# EAGLE design DMXW_Driver_Board (EAGLE 6.5.0)
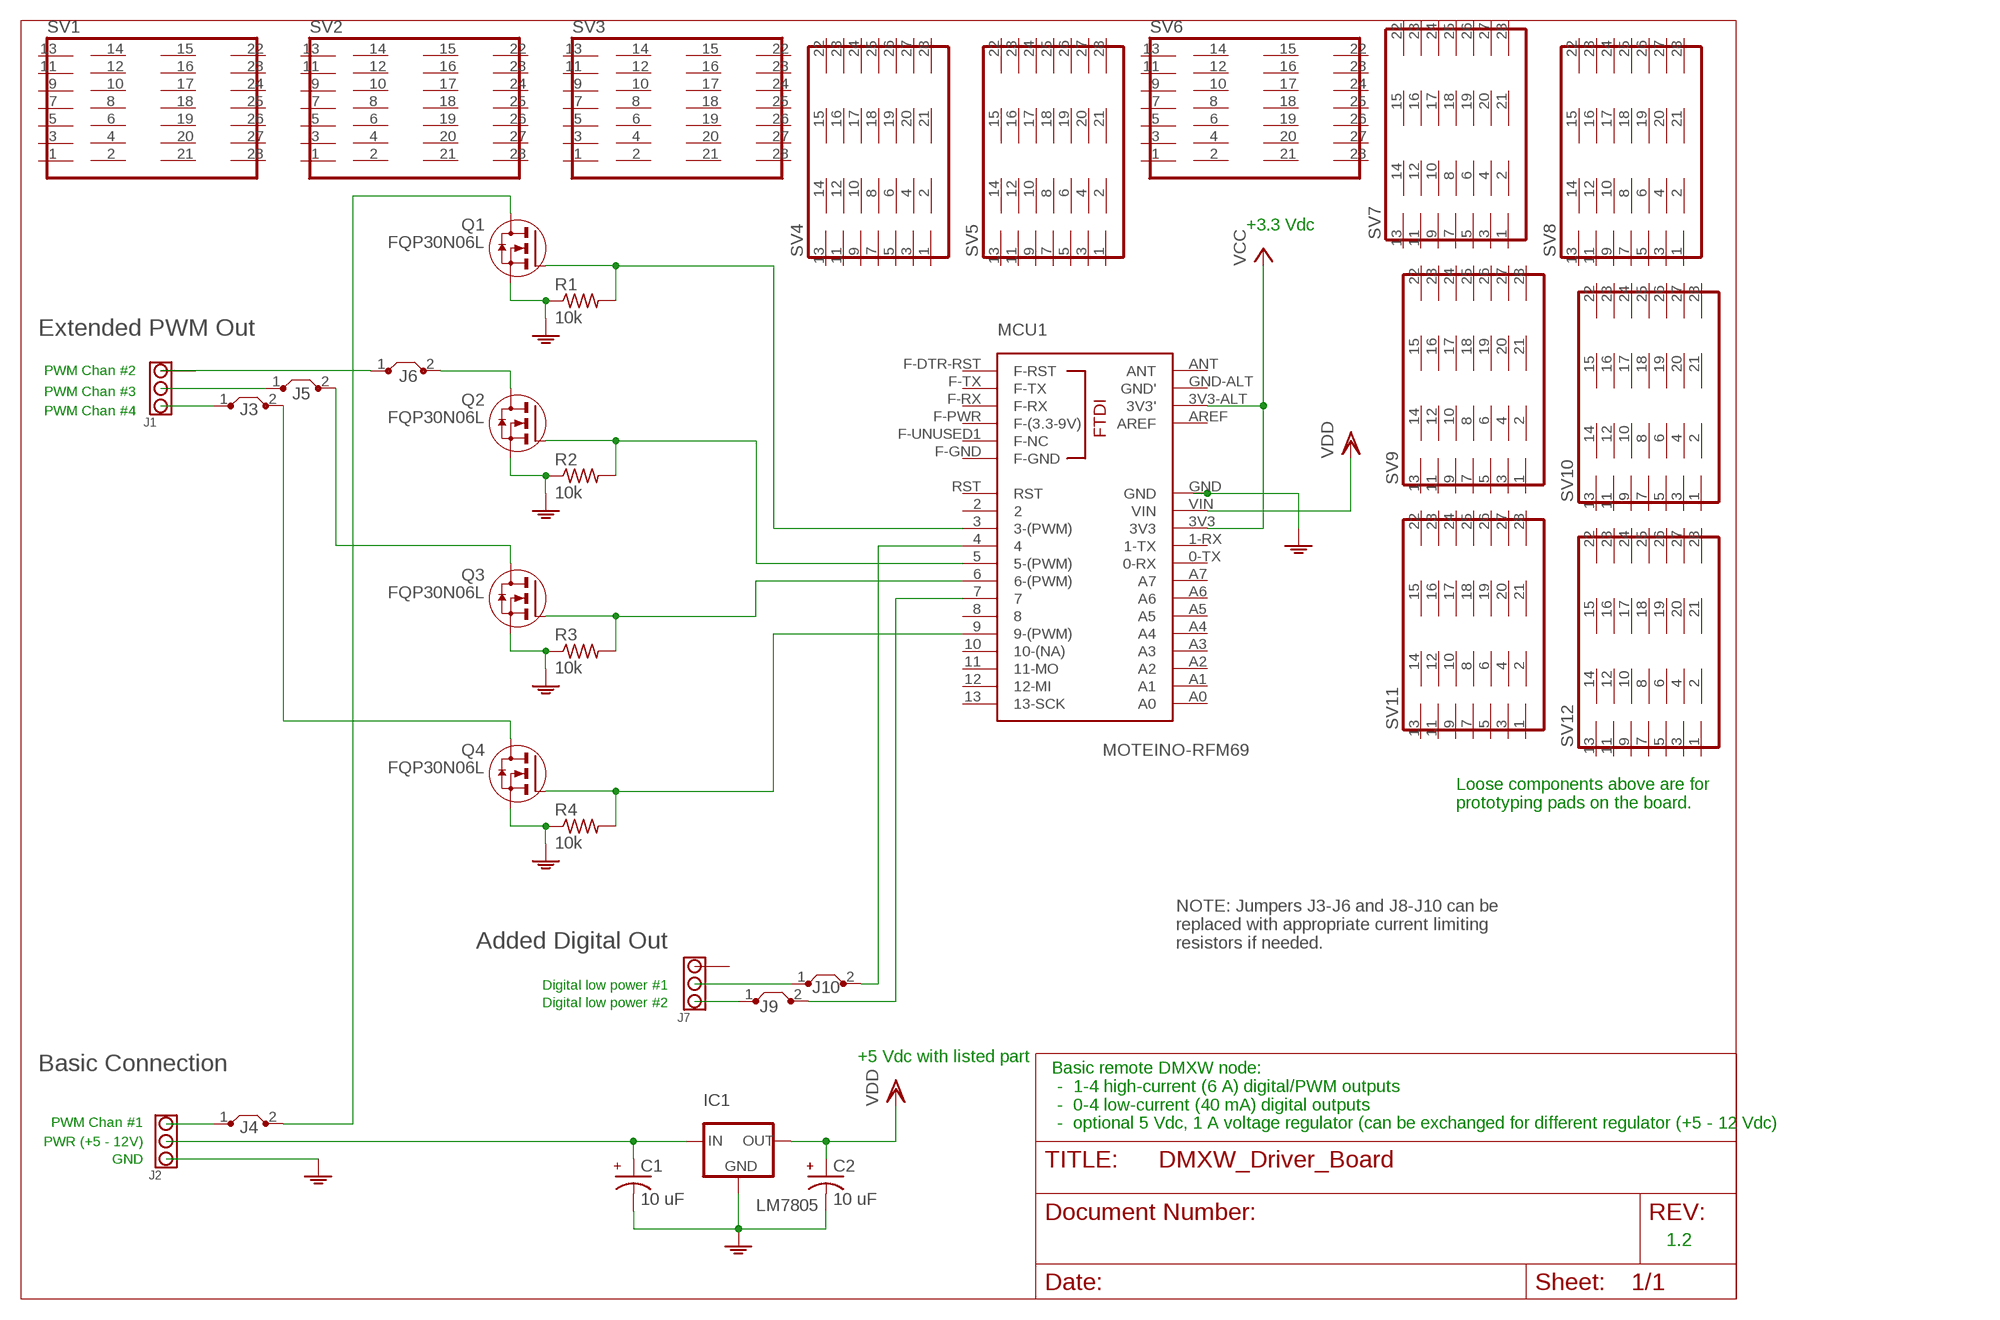
[diagram p0: schematic, sheet 1]

## Parts
C1  10 uF  CAPACITOR-ELECTROLYTICCANISTERRADIAL  [RADIAL-CANISTER]
C2  10 uF  CAPACITOR-ELECTROLYTICCANISTERRADIAL  [RADIAL-CANISTER]
IC1  LM7805  78XX-VOLTAGEREGULATORS  [TO-220]
J1  TERMINAL-BLOCK-3  [W237-103]
J2  TERMINAL-BLOCK-3  [W237-103]
J3  J5MM  [05]
J4  J5MM  [05]
J5  J5MM  [05]
J6  J5MM  [05]
J7  TERMINAL-BLOCK-3  [W237-103]
J9  J5MM  [05]
J10  J5MM  [05]
MCU1  MOTEINO-RFM69  [MOTEINO]
Q1  FQP30N06L  MOSFET-N-FQP30N06L  [TO-220]
Q2  FQP30N06L  MOSFET-N-FQP30N06L  [TO-220]
Q3  FQP30N06L  MOSFET-N-FQP30N06L  [TO-220]
Q4  FQP30N06L  MOSFET-N-FQP30N06L  [TO-220]
R1  10k  R-US_0207/10  [0207/10]
R2  10k  R-US_0207/10  [0207/10]
R3  10k  R-US_0207/10  [0207/10]
R4  10k  R-US_0207/10  [0207/10]
SV1  14P  [14P]
SV2  14P  [14P]
SV3  14P  [14P]
SV4  14P  [14P]
SV5  14P  [14P]
SV6  14P  [14P]
SV7  14P  [14P]
SV8  14P  [14P]
SV9  14P  [14P]
SV10  14P  [14P]
SV11  14P  [14P]
SV12  14P  [14P]

## Nets
GND: C1.- C2.- IC1.PIN2(GND) J2.3 MCU1.GND Q1.PIN3(S) Q2.PIN3(S) Q3.PIN3(S) Q4.PIN3(S) R1.1 R2.1 R3.1 R4.1
N$1: MCU1.5(5-(PWM)) Q2.PIN1(G) R2.2
N$2: J1.1 J6.1
N$3: J1.2 J5.1
N$4: J6.2 Q2.PIN2(D)
N$5: C1.+ IC1.PIN1(IN) J2.2
N$6: MCU1.6(6-(PWM)) Q3.PIN1(G) R3.2
N$7: J5.2 Q3.PIN2(D)
N$8: MCU1.9(9-(PWM)) Q4.PIN1(G) R4.2
N$9: J3.2 Q4.PIN2(D)
N$11: J10.2 MCU1.4
N$12: MCU1.3(3-(PWM)) Q1.PIN1(G) R1.2
N$13: J4.2 Q1.PIN2(D)
N$14: J9.2 MCU1.7
N$16: J7.2 J10.1
N$17: J2.1 J4.1
N$18: J1.3 J3.1
N$21: J7.3 J9.1
VCC: MCU1.3V3 MCU1.3V3-ALT(3V3')
VDD: C2.+ IC1.PIN3(OUT) MCU1.VIN
Unconnected: J7.1 MCU1.0-TX(0-RX) MCU1.1-RX(1-TX) MCU1.2 MCU1.8 MCU1.10(10-(NA)) MCU1.11(11-MO) MCU1.12(12-MI) MCU1.13(13-SCK) MCU1.A0 MCU1.A1 MCU1.A2 MCU1.A3 MCU1.A4 MCU1.A5 MCU1.A6 MCU1.A7 MCU1.ANT MCU1.AREF MCU1.F-DTR-RST(F-RST) MCU1.F-GND MCU1.F-PWR(F-(3.3-9V)) MCU1.F-RX MCU1.F-TX MCU1.F-UNUSED1(F-NC) MCU1.GND-ALT(GND') MCU1.RST SV1.1 SV1.2 SV1.3 SV1.4 SV1.5 SV1.6 SV1.7 SV1.8 SV1.9 SV1.10 SV1.11 SV1.12 SV1.13 SV1.14 SV1.15 SV1.16 SV1.17 SV1.18 SV1.19 SV1.20 SV1.21 SV1.22 SV1.23 SV1.24 SV1.25 SV1.26 SV1.27 SV1.28 SV2.1 SV2.2 SV2.3 SV2.4 SV2.5 SV2.6 SV2.7 SV2.8 SV2.9 SV2.10 SV2.11 SV2.12 SV2.13 SV2.14 SV2.15 SV2.16 SV2.17 SV2.18 SV2.19 SV2.20 SV2.21 SV2.22 SV2.23 SV2.24 SV2.25 SV2.26 SV2.27 SV2.28 SV3.1 SV3.2 SV3.3 SV3.4 SV3.5 SV3.6 SV3.7 SV3.8 SV3.9 SV3.10 SV3.11 SV3.12 SV3.13 SV3.14 SV3.15 SV3.16 SV3.17 SV3.18 SV3.19 SV3.20 SV3.21 SV3.22 SV3.23 SV3.24 SV3.25 SV3.26 SV3.27 SV3.28 SV4.1 SV4.2 SV4.3 SV4.4 SV4.5 SV4.6 SV4.7 SV4.8 SV4.9 SV4.10 SV4.11 SV4.12 SV4.13 SV4.14 SV4.15 SV4.16 SV4.17 SV4.18 SV4.19 SV4.20 SV4.21 SV4.22 SV4.23 SV4.24 SV4.25 SV4.26 SV4.27 SV4.28 SV5.1 SV5.2 SV5.3 SV5.4 SV5.5 SV5.6 SV5.7 SV5.8 SV5.9 SV5.10 SV5.11 SV5.12 SV5.13 SV5.14 SV5.15 SV5.16 SV5.17 SV5.18 SV5.19 SV5.20 SV5.21 SV5.22 SV5.23 SV5.24 SV5.25 SV5.26 SV5.27 SV5.28 SV6.1 SV6.2 SV6.3 SV6.4 SV6.5 SV6.6 SV6.7 SV6.8 SV6.9 SV6.10 SV6.11 SV6.12 SV6.13 SV6.14 SV6.15 SV6.16 SV6.17 SV6.18 SV6.19 SV6.20 SV6.21 SV6.22 SV6.23 SV6.24 SV6.25 SV6.26 SV6.27 SV6.28 SV7.1 SV7.2 SV7.3 SV7.4 SV7.5 SV7.6 SV7.7 SV7.8 SV7.9 SV7.10 SV7.11 SV7.12 SV7.13 SV7.14 SV7.15 SV7.16 SV7.17 SV7.18 SV7.19 SV7.20 SV7.21 SV7.22 SV7.23 SV7.24 SV7.25 SV7.26 SV7.27 SV7.28 SV8.1 SV8.2 SV8.3 SV8.4 SV8.5 SV8.6 SV8.7 SV8.8 SV8.9 SV8.10 SV8.11 SV8.12 SV8.13 SV8.14 SV8.15 SV8.16 SV8.17 SV8.18 SV8.19 SV8.20 SV8.21 SV8.22 SV8.23 SV8.24 SV8.25 SV8.26 SV8.27 SV8.28 SV9.1 SV9.2 SV9.3 SV9.4 SV9.5 SV9.6 SV9.7 SV9.8 SV9.9 SV9.10 SV9.11 SV9.12 SV9.13 SV9.14 SV9.15 SV9.16 SV9.17 SV9.18 SV9.19 SV9.20 SV9.21 SV9.22 SV9.23 SV9.24 SV9.25 SV9.26 SV9.27 SV9.28 SV10.1 SV10.2 SV10.3 SV10.4 SV10.5 SV10.6 SV10.7 SV10.8 SV10.9 SV10.10 SV10.11 SV10.12 SV10.13 SV10.14 SV10.15 SV10.16 SV10.17 SV10.18 SV10.19 SV10.20 SV10.21 SV10.22 SV10.23 SV10.24 SV10.25 SV10.26 SV10.27 SV10.28 SV11.1 SV11.2 SV11.3 SV11.4 SV11.5 SV11.6 SV11.7 SV11.8 SV11.9 SV11.10 SV11.11 SV11.12 SV11.13 SV11.14 SV11.15 SV11.16 SV11.17 SV11.18 SV11.19 SV11.20 SV11.21 SV11.22 SV11.23 SV11.24 SV11.25 SV11.26 SV11.27 SV11.28 SV12.1 SV12.2 SV12.3 SV12.4 SV12.5 SV12.6 SV12.7 SV12.8 SV12.9 SV12.10 SV12.11 SV12.12 SV12.13 SV12.14 SV12.15 SV12.16 SV12.17 SV12.18 SV12.19 SV12.20 SV12.21 SV12.22 SV12.23 SV12.24 SV12.25 SV12.26 SV12.27 SV12.28

## Notes on the sheet
- +3.3 Vdc
- Extended PWM Out
- PWM Chan #2
- PWM Chan #3
- PWM Chan #4
- Loose components above are for
  prototyping pads on the board.
- Added Digital Out
- NOTE: Jumpers J3-J6 and J8-J10 can be
  replaced with appropriate current limiting
  resistors if needed.
- Digital low power #1
- Digital low power #2
- +5 Vdc with listed part
- Basic Connection
- PWM Chan #1
- Basic remote DMXW node:
   -  1-4 high-current (6 A) digital/PWM outputs
   -  0-4 low-current (40 mA) digital outputs
   -  optional 5 Vdc, 1 A voltage regulator (can be exchanged for different regulator (+5 - 12 Vdc)
- PWR (+5 - 12V)
- GND
- 1.2

## Library data of the parts
C1 C2 = JvS:CAPACITOR-ELECTROLYTIC: Electrolytic capacitor, American symbol
IC1 = JvS:78XX-VOLTAGEREGULATORS: 78XX series voltage regulators
J1 J2 J7 = JvS:TERMINAL-BLOCK-3: WAGO SCREW CLAMP
J3-J6 J9 J10 = jumper:J: Bridge
MCU1 = JvS:MOTEINO: Arduino compatible 3.3Vdc microcontroller with RFM69 radio
Q1-Q4 = JvS:MOSFET-N-FQP30N06L: 32A, 60V, 0.032 Ohm, N-Channel Logic Level MOSFET Source: Fairchild Semiconductor Corporation
R1-R4 = rcl:R-US_: RESISTOR, American symbol
SV1-SV12 = JvS:14P: DIL CABLE CONNECTOR

## Board
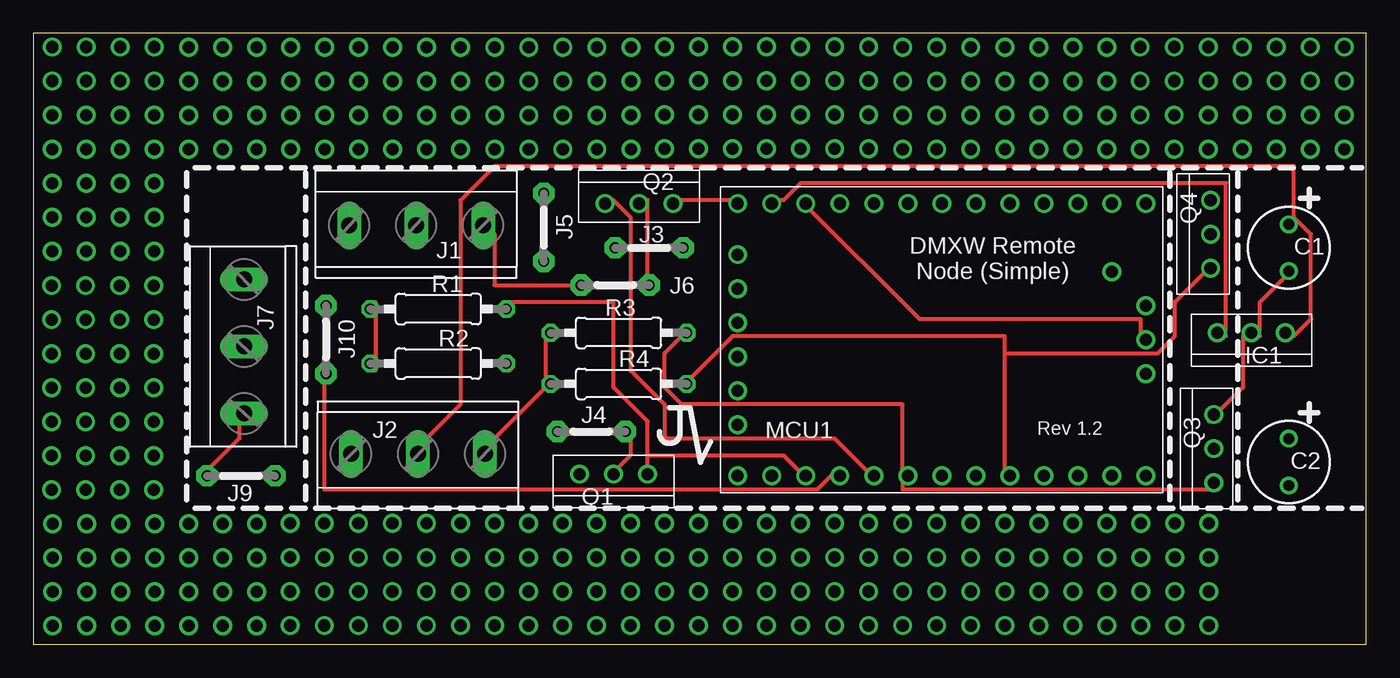
[diagram p1: board, top side]
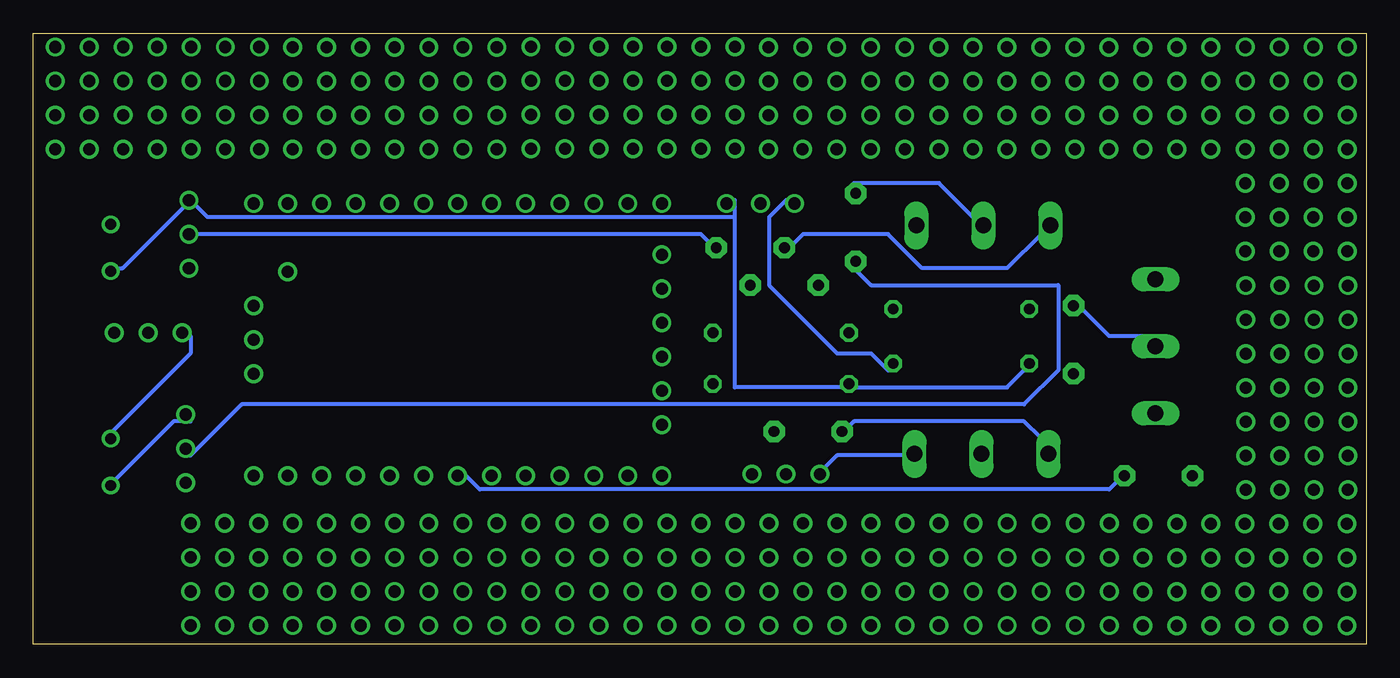
[diagram p2: board, bottom side, seen from below]

Size 99.49 x 45.58 mm. Coordinates in mm from the lower left corner, seen from the top.
Outline: 0,0 99.49,0 99.49,45.58 0,45.58 0,0
Copper layers (1*16): Top 0.035mm / dielectric 1.5mm / Bottom 0.035mm
Design rules "SeeedStudio_2layer_DRU_no_angle_20140221_JVS-wide_traces": minimum track width 12mil, minimum drill 12mil, track to track 6mil, track to pad 6mil, pad to pad 6mil, via to via 6mil, smd to smd 0mil, copper to edge 10mil, drill to drill 10mil, minimum pad ring 10mil, minimum via ring 6mil, stop-mask expansion 2mil, vias tented up to drill 100mil, thermal gap 10mil

### Footprints (pad centres in the part's own frame; a part is rotated, then mirrored left to right if it is on the bottom)
RADIAL-CANISTER = drill 0.8 pad 1.27: + 1.75,0; - -1.75,0
TO-220 = drill 0.9: PIN1 -2.54,0; PIN2 0,0; PIN3 2.54,0
W237-103 = drill 1.194 long: 1 -5,-1.29; 2 0,-1.29; 3 5,-1.29
05 = drill 0.813 pad 1.6 octagon: 1 -2.54,0; 2 2.54,0
MOTEINO = drill 0.9: 0-TX 10.16,5.08; 1-RX 10.16,7.62; 2 -10.16,12.7; 3 -10.16,10.16; 3V3 10.16,10.16; 3V3-ALT 0,-15.24; 4 -10.16,7.62; 5 -10.16,5.08; 6 -10.16,2.54; 7 -10.16,0; 8 -10.16,-2.54; 9 -10.16,-5.08; 10 -10.16,-7.62; 11 -10.16,-10.16; 12 -10.16,-12.7; 13 -10.16,-15.24; A0 10.16,-15.24; A1 10.16,-12.7; A2 10.16,-10.16; A3 10.16,-7.62; A4 10.16,-5.08; A5 10.16,-2.54; A6 10.16,0; A7 10.16,2.54; ANT 5.08,-12.7; AREF -2.54,-15.24; F-DTR-RST 6.35,15.24; F-GND -6.35,15.24; F-PWR -1.27,15.24; F-RX 1.27,15.24; F-TX 3.81,15.24; F-UNUSED1 -3.81,15.24; GND 10.16,15.24; GND-ALT 2.54,-15.24; RST -10.16,15.24; VIN 10.16,12.7
0207/10 = drill 0.813 octagon: 1 -5.08,0; 2 5.08,0
14P = drill 0.9: 1 -7.62,3.81; 2 -7.62,1.27; 3 -5.08,3.81; 4 -5.08,1.27; 5 -2.54,3.81; 6 -2.54,1.27; 7 0,3.81; 8 0,1.27; 9 2.54,3.81; 10 2.54,1.27; 11 5.08,3.81; 12 5.08,1.27; 13 7.62,3.81; 14 7.62,1.27; 15 -7.62,-1.27; 16 -5.08,-1.27; 17 -2.54,-1.27; 18 0,-1.27; 19 2.54,-1.27; 20 5.08,-1.27; 21 7.62,-1.27; 22 -7.62,-3.81; 23 -5.08,-3.81; 24 -2.54,-3.81; 25 0,-3.81; 26 2.54,-3.81; 27 5.08,-3.81; 28 7.62,-3.81

### Placement (x,y rotation side)
C1  93.73,29.59 90 top
C2  93.73,13.59 90 top
IC1  90.93,23.24 180 top
J1  28.57,29.97 180 top
J2  28.7,15.49 0 top
J3  45.97,29.59 0 top
J4  41.66,15.88 0 top
J5  38.1,31.11 270 top
J6  43.43,26.8 0 top
J7  17.02,22.22 270 top
J9  15.49,12.57 0 top
J10  21.84,22.73 270 top
MCU1  67.82,22.73 90 top
Q1  43.31,12.7 180 top
Q2  45.21,32.89 0 top
Q3  88.14,14.61 90 top
Q4  87.88,30.61 90 top
R1  30.23,25.02 0 top
R2  30.23,20.95 0 top
R3  43.69,23.24 0 top
R4  43.69,19.43 0 top
SV1  5.16,19.15 270 top
SV2  19.2,40.74 180 top
SV3  36.98,40.74 0 top
SV4  54.74,40.79 0 top
SV5  72.52,40.74 0 top
SV6  5.21,36.96 90 top
SV7  90.25,40.77 0 top
SV8  9.04,5.18 180 top
SV9  26.8,5.21 0 top
SV10  44.58,5.21 0 top
SV11  62.36,5.21 0 top
SV12  80.14,5.21 0 top

### Tracks (layer width: path | path; a pad name or v marks a point on that pad's centre or on a via)
GND
  Top 0.305: C1.- 94.11,28.07 91.57,25.53 91.57,22.99 IC1.PIN2 90.3,22.99 90.3,19.18 87.76,16.64 Q3.PIN3 | Q2.PIN3 48.39,33.15 52.2,33.15 MCU1.GND | R2.1 25.53,20.45 25.53,25.53 R1.1 | 38.23,19.18 38.23,22.99 R3.1 | 38.23,19.18 34.42,15.37 J2.3 | 38.23,19.18 R4.1
  Bottom 0.305: C2.- 94.11,11.56 89.03,16.64 87.76,16.64 Q3.PIN3 | 87.76,33.15 92.84,28.07 94.11,28.07 C1.- | Q1.PIN3 40.77,12.83 39.5,14.1 34.42,14.1 J2.3 | 38.23,19.18 26.8,19.18 25.53,20.45 R2.1 | 47.12,31.88 47.12,19.18 38.23,19.18 | 47.12,31.88 47.12,33.15 Q2.PIN3 | 38.23,19.18 R4.1 | 87.76,33.15 86.49,31.88 47.12,31.88 | 87.76,33.15 Q4.PIN3
N$1
  Top 0.305: MCU1.5 62.36,12.83 59.82,15.37 47.12,15.37 47.12,17.91 44.58,20.45 44.58,31.88 43.31,33.15 Q2.PIN1
  Bottom 0.305: R2.2 35.69,20.45 36.96,21.72 39.5,21.72 44.58,26.8 44.58,31.88 43.31,33.15 Q2.PIN1
N$2
  Top 0.305: J6.1 34.42,26.8 34.42,30.61 J1.1
N$3
  Bottom 0.305: J5.1 38.23,34.42 31.88,34.42 29.34,31.88 J1.2
N$4
  Top 0.305: Q2.PIN2 45.85,33.15 45.85,26.8 J6.2
N$5
  Top 0.305: 94.11,31.88 95.38,30.61 95.38,24.26 94.11,22.99 IC1.PIN1 | 94.11,31.88 94.11,35.69 34.42,35.69 31.88,33.15 31.88,17.91 29.34,15.37 J2.2 | 94.11,31.88 C1.+
N$6
  Top 0.305: 64.9,12.83 64.9,17.91 48.39,17.91 47.12,19.18 47.12,21.72 48.39,22.99 R3.2 | 64.9,12.83 64.9,11.56 87.76,11.56 Q3.PIN1 | 64.9,12.83 MCU1.6
N$7
  Bottom 0.305: Q3.PIN2 87.76,14.1 83.95,17.91 25.53,17.91 22.99,20.45 22.99,26.8 36.96,26.8 38.23,28.07 J5.2
N$8
  Top 0.305: 72.52,21.72 72.52,12.83 MCU1.9 | 72.52,21.72 72.52,22.99 52.2,22.99 48.39,19.18 R4.2 | 72.52,21.72 83.95,21.72 85.22,22.99 85.22,25.53 87.76,28.07 Q4.PIN1
N$9
  Bottom 0.305: Q4.PIN2 49.66,30.61 48.39,29.34 J3.2
N$11
  Top 0.305: MCU1.4 59.82,12.83 58.55,11.56 21.72,11.56 21.72,20.45 J10.2
N$12
  Top 0.305: Q1.PIN1 45.85,14.1 | 45.85,14.1 45.85,16.64 43.31,19.18 43.31,25.53 35.69,25.53 R1.2 | 45.85,14.1 56.01,14.1 57.28,12.83 MCU1.3
N$13
  Top 0.305: Q1.PIN2 43.31,12.83 44.58,14.1 44.58,15.37 J4.2
N$14
  Bottom 0.305: MCU1.7 67.44,12.83 66.17,11.56 19.18,11.56 17.91,12.83 J9.2
N$16
  Bottom 0.305: J10.1 21.72,25.53 19.18,22.99 16.64,22.99 J7.2
N$17
  Bottom 0.305: J4.1 39.5,15.37 38.23,16.64 25.53,16.64 24.26,15.37 J2.1
N$18
  Bottom 0.305: J3.1 43.31,29.34 42.04,30.61 35.69,30.61 33.15,28.07 26.8,28.07 24.26,30.61 J1.3
N$21
  Top 0.305: J9.1 12.83,12.83 15.37,15.37 15.37,16.64 J7.3
VCC
  Top 0.305: MCU1.3V3 57.28,33.15 66.17,24.26 82.68,24.26 82.68,22.99 MCU1.3V3-ALT
VDD
  Top 0.305: MCU1.VIN 54.74,33.15 56.01,33.15 57.28,34.42 89.03,34.42 89.03,22.99 IC1.PIN3
  Bottom 0.305: C2.+ 94.11,15.37 87.76,21.72 87.76,22.99 IC1.PIN3

### Text on the board
tNames: DMXW Remote / Node (Simple) | Rev 1.2